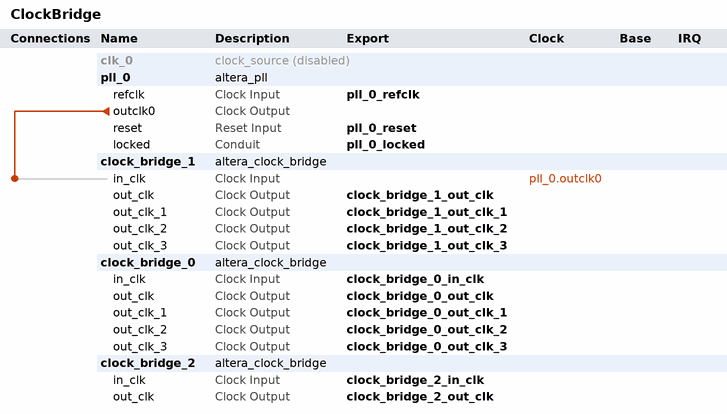
[diagram p0: system contents]
# Platform Designer (Qsys) system ClockBridge, Cyclone V 5CSEMA4U23C6
# Parameters at their usual value, and those the tool derives, are not listed.
package require -exact qsys 23.1
create_system ClockBridge
set_project_property DEVICE_FAMILY {Cyclone V}
set_project_property DEVICE 5CSEMA4U23C6

add_instance clk_0 clock_source 23.1
set_instance_property clk_0 ENABLED false
set_instance_parameter_value clk_0 clockFrequency 50000000

add_instance pll_0 altera_pll 23.1
set_instance_parameter_value pll_0 gui_device_speed_grade 2
set_instance_parameter_value pll_0 gui_number_of_clocks 1
set_instance_parameter_value pll_0 gui_operation_mode normal
set_instance_parameter_value pll_0 gui_output_clock_frequency0 100.0
set_instance_parameter_value pll_0 gui_pll_mode {Integer-N PLL}
set_instance_parameter_value pll_0 gui_reference_clock_frequency 50.0
set_instance_parameter_value pll_0 gui_use_locked true

add_instance clock_bridge_1 altera_clock_bridge 23.1
set_instance_parameter_value clock_bridge_1 DERIVED_CLOCK_RATE 100000000
set_instance_parameter_value clock_bridge_1 EXPLICIT_CLOCK_RATE 0
set_instance_parameter_value clock_bridge_1 NUM_CLOCK_OUTPUTS 4

add_instance clock_bridge_0 altera_clock_bridge 23.1
set_instance_parameter_value clock_bridge_0 DERIVED_CLOCK_RATE 0
set_instance_parameter_value clock_bridge_0 EXPLICIT_CLOCK_RATE 0
set_instance_parameter_value clock_bridge_0 NUM_CLOCK_OUTPUTS 4

add_instance clock_bridge_2 altera_clock_bridge 23.1
set_instance_parameter_value clock_bridge_2 DERIVED_CLOCK_RATE 0
set_instance_parameter_value clock_bridge_2 EXPLICIT_CLOCK_RATE 0

# connections
add_connection pll_0.outclk0 clock_bridge_1.in_clk clock

# exported interfaces
add_interface clock_bridge_0_in_clk clock sink
set_interface_property clock_bridge_0_in_clk EXPORT_OF clock_bridge_0.in_clk
add_interface clock_bridge_0_out_clk clock source
set_interface_property clock_bridge_0_out_clk EXPORT_OF clock_bridge_0.out_clk
add_interface clock_bridge_0_out_clk_1 clock source
set_interface_property clock_bridge_0_out_clk_1 EXPORT_OF clock_bridge_0.out_clk_1
add_interface clock_bridge_0_out_clk_2 clock source
set_interface_property clock_bridge_0_out_clk_2 EXPORT_OF clock_bridge_0.out_clk_2
add_interface clock_bridge_0_out_clk_3 clock source
set_interface_property clock_bridge_0_out_clk_3 EXPORT_OF clock_bridge_0.out_clk_3
add_interface clock_bridge_1_out_clk clock source
set_interface_property clock_bridge_1_out_clk EXPORT_OF clock_bridge_1.out_clk
add_interface clock_bridge_1_out_clk_1 clock source
set_interface_property clock_bridge_1_out_clk_1 EXPORT_OF clock_bridge_1.out_clk_1
add_interface clock_bridge_1_out_clk_2 clock source
set_interface_property clock_bridge_1_out_clk_2 EXPORT_OF clock_bridge_1.out_clk_2
add_interface clock_bridge_1_out_clk_3 clock source
set_interface_property clock_bridge_1_out_clk_3 EXPORT_OF clock_bridge_1.out_clk_3
add_interface clock_bridge_2_in_clk clock sink
set_interface_property clock_bridge_2_in_clk EXPORT_OF clock_bridge_2.in_clk
add_interface clock_bridge_2_out_clk clock source
set_interface_property clock_bridge_2_out_clk EXPORT_OF clock_bridge_2.out_clk
add_interface pll_0_locked conduit end
set_interface_property pll_0_locked EXPORT_OF pll_0.locked
add_interface pll_0_refclk clock sink
set_interface_property pll_0_refclk EXPORT_OF pll_0.refclk
add_interface pll_0_reset reset sink
set_interface_property pll_0_reset EXPORT_OF pll_0.reset

set_interconnect_requirement {$system} qsys_mm.clockCrossingAdapter HANDSHAKE
set_interconnect_requirement {$system} qsys_mm.enableEccProtection FALSE
set_interconnect_requirement {$system} qsys_mm.insertDefaultSlave FALSE
set_interconnect_requirement {$system} qsys_mm.maxAdditionalLatency 1

save_system ClockBridge.qsys
